# Altium schematic sheet [03] - CONNECTORS.SchDoc
size A4; Date: 07/05/2016; CheckedBy: Javier Guillemat; Author: Javier Jiménez; CompanyName: Guilletronic; Organization: Guilletronic; Address1: Calle del Cel Nº14; Address2: Las Colinas; Address3: 08818 Olivella; DocumentNumber: 3; Revision: A; SheetNumber: 3; SheetTotal: 6
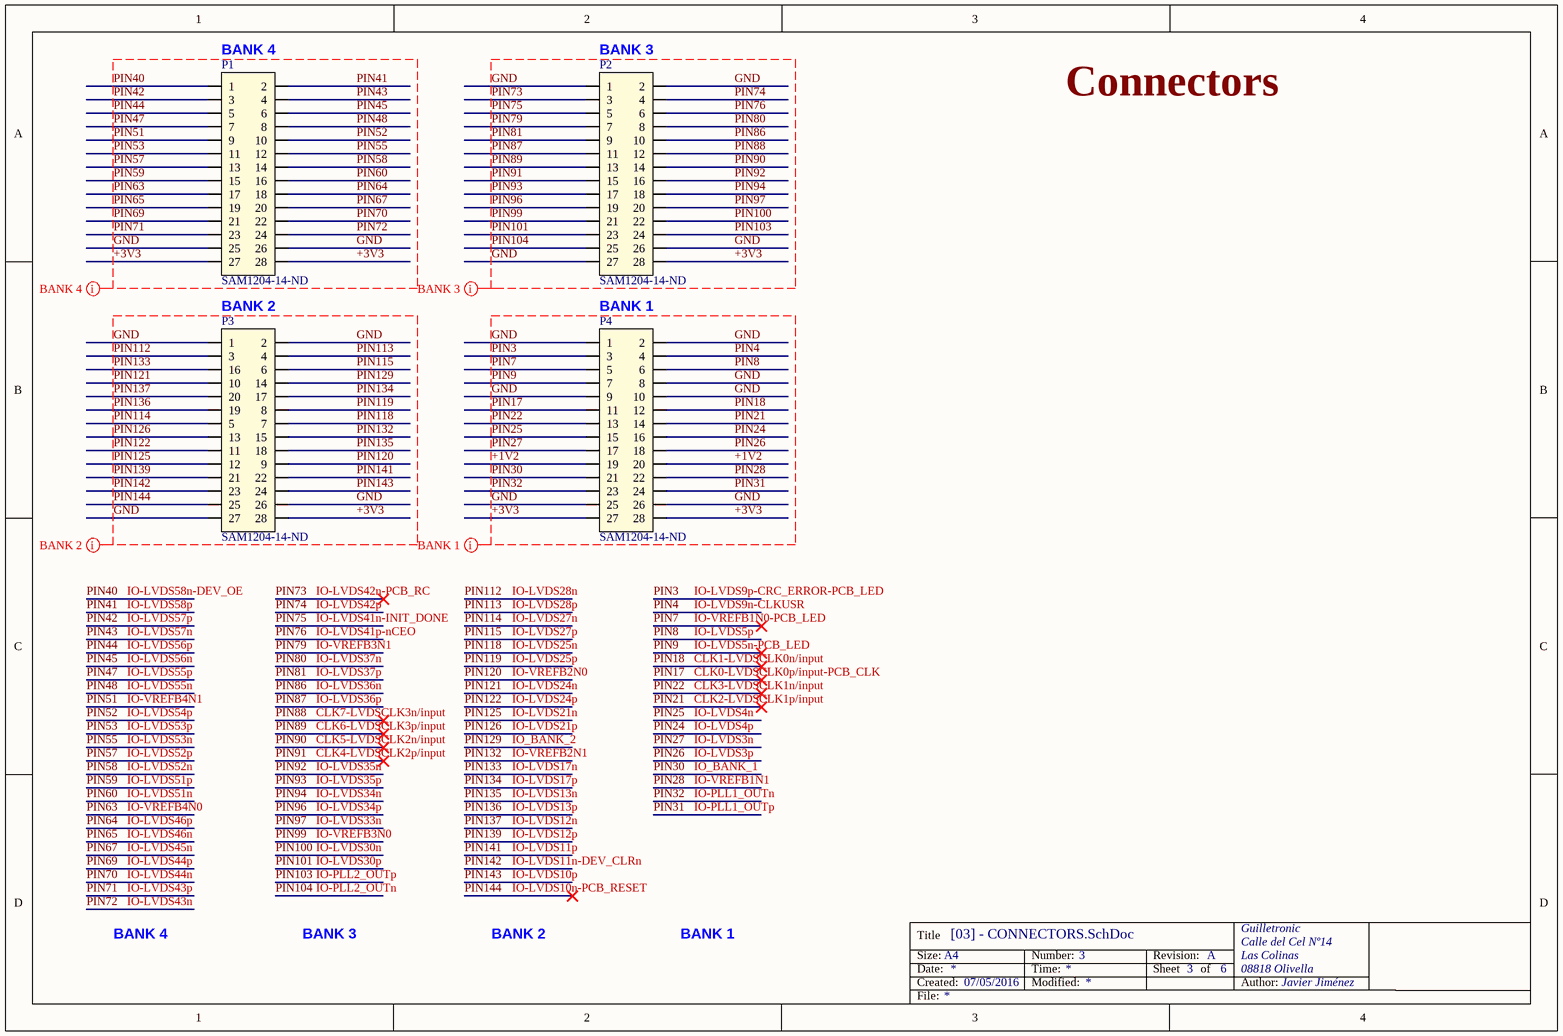
[diagram p0: [03] - CONNECTORS.SchDoc]

## Parts
P1  Supplier Part Number 1: SAM1204-14-ND  [Female Header 14x2 2.54mm 10mm]  (hidden comment: Female Header 14x2 2.54mm 10mm)
P2  Supplier Part Number 1: SAM1204-14-ND  [Female Header 14x2 2.54mm 10mm]  (hidden comment: Female Header 14x2 2.54mm 10mm)
P3  Supplier Part Number 1: SAM1204-14-ND  [Female Header 14x2 2.54mm 10mm]  (hidden comment: Female Header 14x2 2.54mm 10mm)
P4  Supplier Part Number 1: SAM1204-14-ND  [Female Header 14x2 2.54mm 10mm]  (hidden comment: Female Header 14x2 2.54mm 10mm)

## Nets
+1V2: P4.19 P4.20
+3V3: P1.27 P1.28 P2.28 P3.28 P4.27 P4.28
GND: P1.25 P1.26 P2.1 P2.2 P2.26 P2.27 P3.1 P3.2 P3.26 P3.27 P4.1 P4.2 P4.8 P4.9 P4.10 P4.25 P4.26
PIN3: P4.3
PIN4: P4.4
PIN7: P4.5
PIN8: P4.6
PIN9: P4.7
PIN17: P4.11
PIN18: P4.12
PIN21: P4.14
PIN22: P4.13
PIN24: P4.16
PIN25: P4.15
PIN26: P4.18
PIN27: P4.17
PIN28: P4.22
PIN30: P4.21
PIN31: P4.24
PIN32: P4.23
PIN40: P1.1
PIN41: P1.2
PIN42: P1.3
PIN43: P1.4
PIN44: P1.5
PIN45: P1.6
PIN47: P1.7
PIN48: P1.8
PIN51: P1.9
PIN52: P1.10
PIN53: P1.11
PIN55: P1.12
PIN57: P1.13
PIN58: P1.14
PIN59: P1.15
PIN60: P1.16
PIN63: P1.17
PIN64: P1.18
PIN65: P1.19
PIN67: P1.20
PIN69: P1.21
PIN70: P1.22
PIN71: P1.23
PIN72: P1.24
PIN73: P2.3
PIN74: P2.4
PIN75: P2.5
PIN76: P2.6
PIN79: P2.7
PIN80: P2.8
PIN81: P2.9
PIN86: P2.10
PIN87: P2.11
PIN88: P2.12
PIN89: P2.13
PIN90: P2.14
PIN91: P2.15
PIN92: P2.16
PIN93: P2.17
PIN94: P2.18
PIN96: P2.19
PIN97: P2.20
PIN99: P2.21
PIN100: P2.22
PIN101: P2.23
PIN103: P2.24
PIN104: P2.25
PIN112: P3.3
PIN113: P3.4
PIN114: P3.5
PIN115: P3.6
PIN118: P3.7
PIN119: P3.8
PIN120: P3.9
PIN121: P3.10
PIN122: P3.11
PIN125: P3.12
PIN126: P3.13
PIN129: P3.14
PIN132: P3.15
PIN133: P3.16
PIN134: P3.17
PIN135: P3.18
PIN136: P3.19
PIN137: P3.20
PIN139: P3.21
PIN141: P3.22
PIN142: P3.23
PIN143: P3.24
PIN144: P3.25

## Layout directives
net class BANK 2: +3V3, GND, PIN112, PIN113, PIN114, PIN115, PIN118, PIN119, PIN120, PIN121, PIN122, PIN125, PIN126, PIN129, PIN132, PIN133, PIN134, PIN135, PIN136, PIN137, PIN139, PIN141, PIN142, PIN143, PIN144
net class BANK 3: +3V3, GND, PIN73, PIN74, PIN75, PIN76, PIN79, PIN80, PIN81, PIN86, PIN87, PIN88, PIN89, PIN90, PIN91, PIN92, PIN93, PIN94, PIN96, PIN97, PIN99, PIN100, PIN101, PIN103, PIN104
net class BANK 4: +3V3, GND, PIN40, PIN41, PIN42, PIN43, PIN44, PIN45, PIN47, PIN48, PIN51, PIN52, PIN53, PIN55, PIN57, PIN58, PIN59, PIN60, PIN63, PIN64, PIN65, PIN67, PIN69, PIN70, PIN71, PIN72
net class BANK 1: +1V2, +3V3, GND, PIN3, PIN4, PIN7, PIN8, PIN9, PIN17, PIN18, PIN21, PIN22, PIN24, PIN25, PIN26, PIN27, PIN28, PIN30, PIN31, PIN32

## Notes on the sheet
- (near P1) BANK 4
- (near P2) BANK 3
- Connectors
- BANK 2
- BANK 1
- IO-LVDS58n-DEV_OE
- IO-LVDS58p
- IO-LVDS57p
- IO-LVDS57n
- IO-LVDS56p
- IO-LVDS42n-PCB_RC
- IO-LVDS42p
- IO-LVDS41n-INIT_DONE
- IO-LVDS41p-nCEO
- IO-VREFB3N1
- IO-LVDS28n
- IO-LVDS28p
- IO-LVDS27n
- IO-LVDS27p
- IO-LVDS25n
- IO-LVDS9p-CRC_ERROR-PCB_LED
- IO-LVDS9n-CLKUSR
- IO-VREFB1N0-PCB_LED
- IO-LVDS5p
- IO-LVDS5n-PCB_LED
- IO-LVDS56n
- IO-LVDS55p
- IO-LVDS55n
- IO-VREFB4N1
- IO-LVDS54p
- IO-LVDS37n
- IO-LVDS37p
- IO-LVDS36n
- IO-LVDS36p
- CLK7-LVDSCLK3n/input
- IO-LVDS25p
- IO-VREFB2N0
- IO-LVDS24n
- IO-LVDS24p
- IO-LVDS21n
- CLK1-LVDSCLK0n/input
- CLK0-LVDSCLK0p/input-PCB_CLK
- CLK3-LVDSCLK1n/input
- CLK2-LVDSCLK1p/input
- IO-LVDS4n
- IO-LVDS53p
- IO-LVDS53n
- IO-LVDS52p
- IO-LVDS52n
- IO-LVDS51p
- CLK6-LVDSCLK3p/input
- CLK5-LVDSCLK2n/input
- CLK4-LVDSCLK2p/input
- IO-LVDS35n
- IO-LVDS35p
- IO-LVDS21p
- IO_BANK_2
- IO-VREFB2N1
- IO-LVDS17n
- IO-LVDS17p
- IO-LVDS4p
- IO-LVDS3n
- IO-LVDS3p
- IO_BANK_1
- IO-VREFB1N1
- IO-LVDS51n
- IO-VREFB4N0
- IO-LVDS46p
- IO-LVDS46n
- IO-LVDS45n
- IO-LVDS34n
- IO-LVDS34p
- IO-LVDS33n
- IO-VREFB3N0
- IO-LVDS30n
- IO-LVDS13n
- IO-LVDS13p
- IO-LVDS12n
- IO-LVDS12p
- IO-LVDS11p
- IO-PLL1_OUTn
- IO-PLL1_OUTp
- IO-LVDS44p
- IO-LVDS44n
- IO-LVDS43p
- IO-LVDS43n
- IO-LVDS30p
- IO-PLL2_OUTp
- IO-PLL2_OUTn
- IO-LVDS11n-DEV_CLRn
- IO-LVDS10p
- IO-LVDS10n-PCB_RESET
- BANK 4
- BANK 3
- Title
- Size:
- Date:
- Created:
- A4
- Number:
- Time:
- Modified:
- Revision:
- Sheet
- of
- Author:
- File:

## Library data of the parts
P1-P4 = Female Header 14x2 2.54mm 10mm: ELEVATED SOCKET STRIPS; Style: Board to Board; Number of Positions: 14; Number of Positions Loaded: All; Pitch - Mating: 0.100" (2.54mm); Contact Length - Post: 0.090" (2.29mm); Material Flammability Rating: UL94 V-0; Current Rating: 5.7A per Contact; Voltage Rating: 550VAC; Description 2: CONN HEADER FMAL 28PS .1" DL TIN; Category 2: Connectors, Interconnects; RoHS: RoHS Compliant; Packaging: Tube; Part Status: Active; Connector Type: Elevated Socket; Contact Type: Forked; Number of Rows: 2; Row Spacing - Mating: 0.100" (2.54mm); Mounting Type: Through Hole; Termination: Solder; Fastening Type: Push-Pull; Contact Finish - Mating: Gold; Contact Finish Thickness - Mating: 20µin (0.51µm); Insulation Color: Black; Insulation Height: 0.435" (11.05mm); Operating Temperature: -55°C ~ 125°C; Contact Finish - Post: Gold; Mated Stacking Heights: -; Ingress Protection: -; Features: -; Applications: -; Insulation Material: Liquid Crystal Polymer (LCP); Contact Shape: Square; Contact Material: Phosphor Bronze; Contact Finish Thickness - Post: 3µin (0.08µm); ComponentLink1URL: http://suddendocs.samtec.com/prints/esq-1xx-xx-x-x-xxx-xx-x-xx-mkt.pdf; ComponentLink1Description: http://suddendocs.samtec.com/prints/esq-1xx-xx-x-x-xxx-xx-x-xx-mkt.pdf; ComponentLink2URL: http://www.sullinscorp.com/drawings/78_P(N)PxCxxxLFBN-RC,_10492-H.pdf; ComponentLink2Description: http://www.sullinscorp.com/drawings/78_P(N)PxCxxxLFBN-RC,_10492-H.pdf; Supplier 1: Digi-Key; Manufacturer 2: Sullins Connector Solutions; Manufacturer Part Number 2: PPTC142LFBN-RC; Stock 2: 1937; Pricing 2: 1=1.92, 10=1.586, 25=1.4868, 50=1.3216, 100=1.1894, 250=1.09692, 500=0.9912, 1000=0.87886, 2500=0.84252 (EUR)